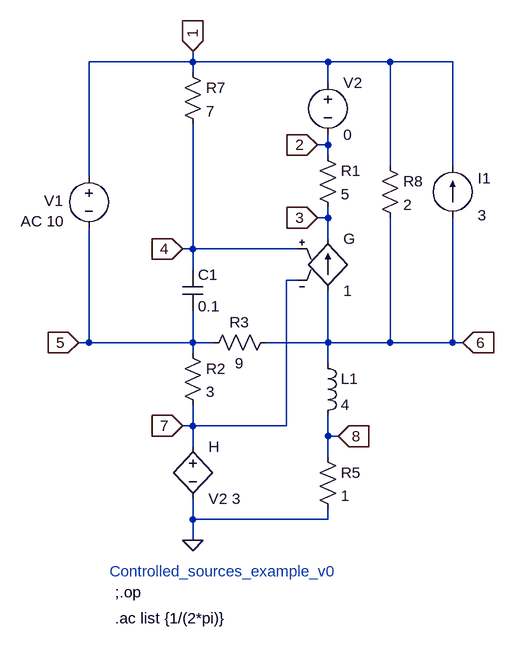
[diagram p0: schematic Controlled_sources_example_v0.asc]
Controlled_sources_example_v0.asc, the LTspice schematic file:
Version 4
SHEET 1 1092 1204
WIRE 272 128 272 112
WIRE 272 128 112 128
WIRE 480 128 272 128
WIRE 576 128 480 128
WIRE 672 128 576 128
WIRE 272 144 272 128
WIRE 480 160 480 128
WIRE 480 256 480 240
WIRE 480 256 464 256
WIRE 480 272 480 256
WIRE 576 288 576 128
WIRE 672 288 672 128
WIRE 112 304 112 128
WIRE 480 368 480 352
WIRE 480 368 464 368
WIRE 480 400 480 368
WIRE 272 416 272 224
WIRE 272 416 256 416
WIRE 432 416 272 416
WIRE 272 448 272 416
WIRE 432 464 416 464
WIRE 112 560 112 384
WIRE 112 560 96 560
WIRE 272 560 272 512
WIRE 272 560 112 560
WIRE 304 560 272 560
WIRE 480 560 480 480
WIRE 480 560 384 560
WIRE 576 560 576 368
WIRE 576 560 480 560
WIRE 672 560 672 368
WIRE 672 560 576 560
WIRE 688 560 672 560
WIRE 272 576 272 560
WIRE 480 592 480 560
WIRE 272 688 272 656
WIRE 272 688 256 688
WIRE 416 688 416 464
WIRE 416 688 272 688
WIRE 480 704 480 672
WIRE 496 704 480 704
WIRE 272 720 272 688
WIRE 480 736 480 704
WIRE 272 832 272 800
WIRE 480 832 480 816
WIRE 480 832 272 832
WIRE 272 864 272 832
FLAG 272 864 0
FLAG 272 112 1
IOPIN 272 112 In
FLAG 256 416 4
IOPIN 256 416 In
FLAG 464 368 3
IOPIN 464 368 In
FLAG 96 560 5
IOPIN 96 560 In
FLAG 688 560 6
IOPIN 688 560 In
FLAG 256 688 7
IOPIN 256 688 In
FLAG 496 704 8
IOPIN 496 704 In
FLAG 464 256 2
IOPIN 464 256 In
SYMBOL current 672 368 R180
WINDOW 39 0 0 Left 0
WINDOW 0 -59 61 Left 2
WINDOW 3 -52 4 Left 2
SYMATTR InstName I1
SYMATTR Value 3
SYMATTR Value2 AC 0
SYMBOL g 480 384 R0
SYMATTR InstName G
SYMATTR Value 1
SYMBOL h 272 704 R0
SYMATTR InstName H
SYMATTR Value V2 3
SYMBOL voltage 112 288 R0
WINDOW 3 24 152 Invisible 2
WINDOW 123 -105 85 Left 2
WINDOW 39 0 0 Left 0
WINDOW 0 -69 54 Left 2
SYMATTR Value 0
SYMATTR Value2 AC 10
SYMATTR InstName V1
SYMBOL cap 256 448 R0
SYMATTR InstName C1
SYMATTR Value 0.1
SYMBOL ind 464 576 R0
SYMATTR InstName L1
SYMATTR Value 4
SYMATTR SpiceLine Rser=0
SYMBOL res 464 256 R0
SYMATTR InstName R1
SYMATTR Value 5
SYMBOL res 256 560 R0
SYMATTR InstName R2
SYMATTR Value 3
SYMBOL res 400 544 R90
WINDOW 0 0 56 VBottom 2
WINDOW 3 32 56 VTop 2
SYMATTR InstName R3
SYMATTR Value 9
SYMBOL voltage 480 144 R0
WINDOW 123 0 0 Left 0
WINDOW 39 0 0 Left 0
SYMATTR InstName V2
SYMATTR Value 0
SYMBOL res 464 720 R0
SYMATTR InstName R5
SYMATTR Value 1
SYMBOL res 256 128 R0
SYMATTR InstName R7
SYMATTR Value 7
SYMBOL res 560 272 R0
SYMATTR InstName R8
SYMATTR Value 2
TEXT 144 912 Left 2 ;Controlled_sources_example_v0
TEXT 152 944 Left 2 !;.op
TEXT 152 984 Left 2 !.ac list {1/(2*pi)}

The netlist it stands for:
* Controlled_sources_example_v0.asc
I1 6 1 3 AC 0
G 6 3 4 7 1
H 7 0 V2 3
V1 1 5 0 AC 10
C1 4 5 0.1
L1 6 8 4 Rser=0
R1 2 3 5
R2 5 7 3
R3 6 5 9
V2 1 2 0
R5 8 0 1
R7 1 4 7
R8 1 6 2
* Controlled_sources_example_v0
;.op
.ac list {1/(2*pi)}
.backanno
.end